# EAGLE design Netzteil_CA1 (EAGLE 8.6.3)

## Sheet 1 of 3
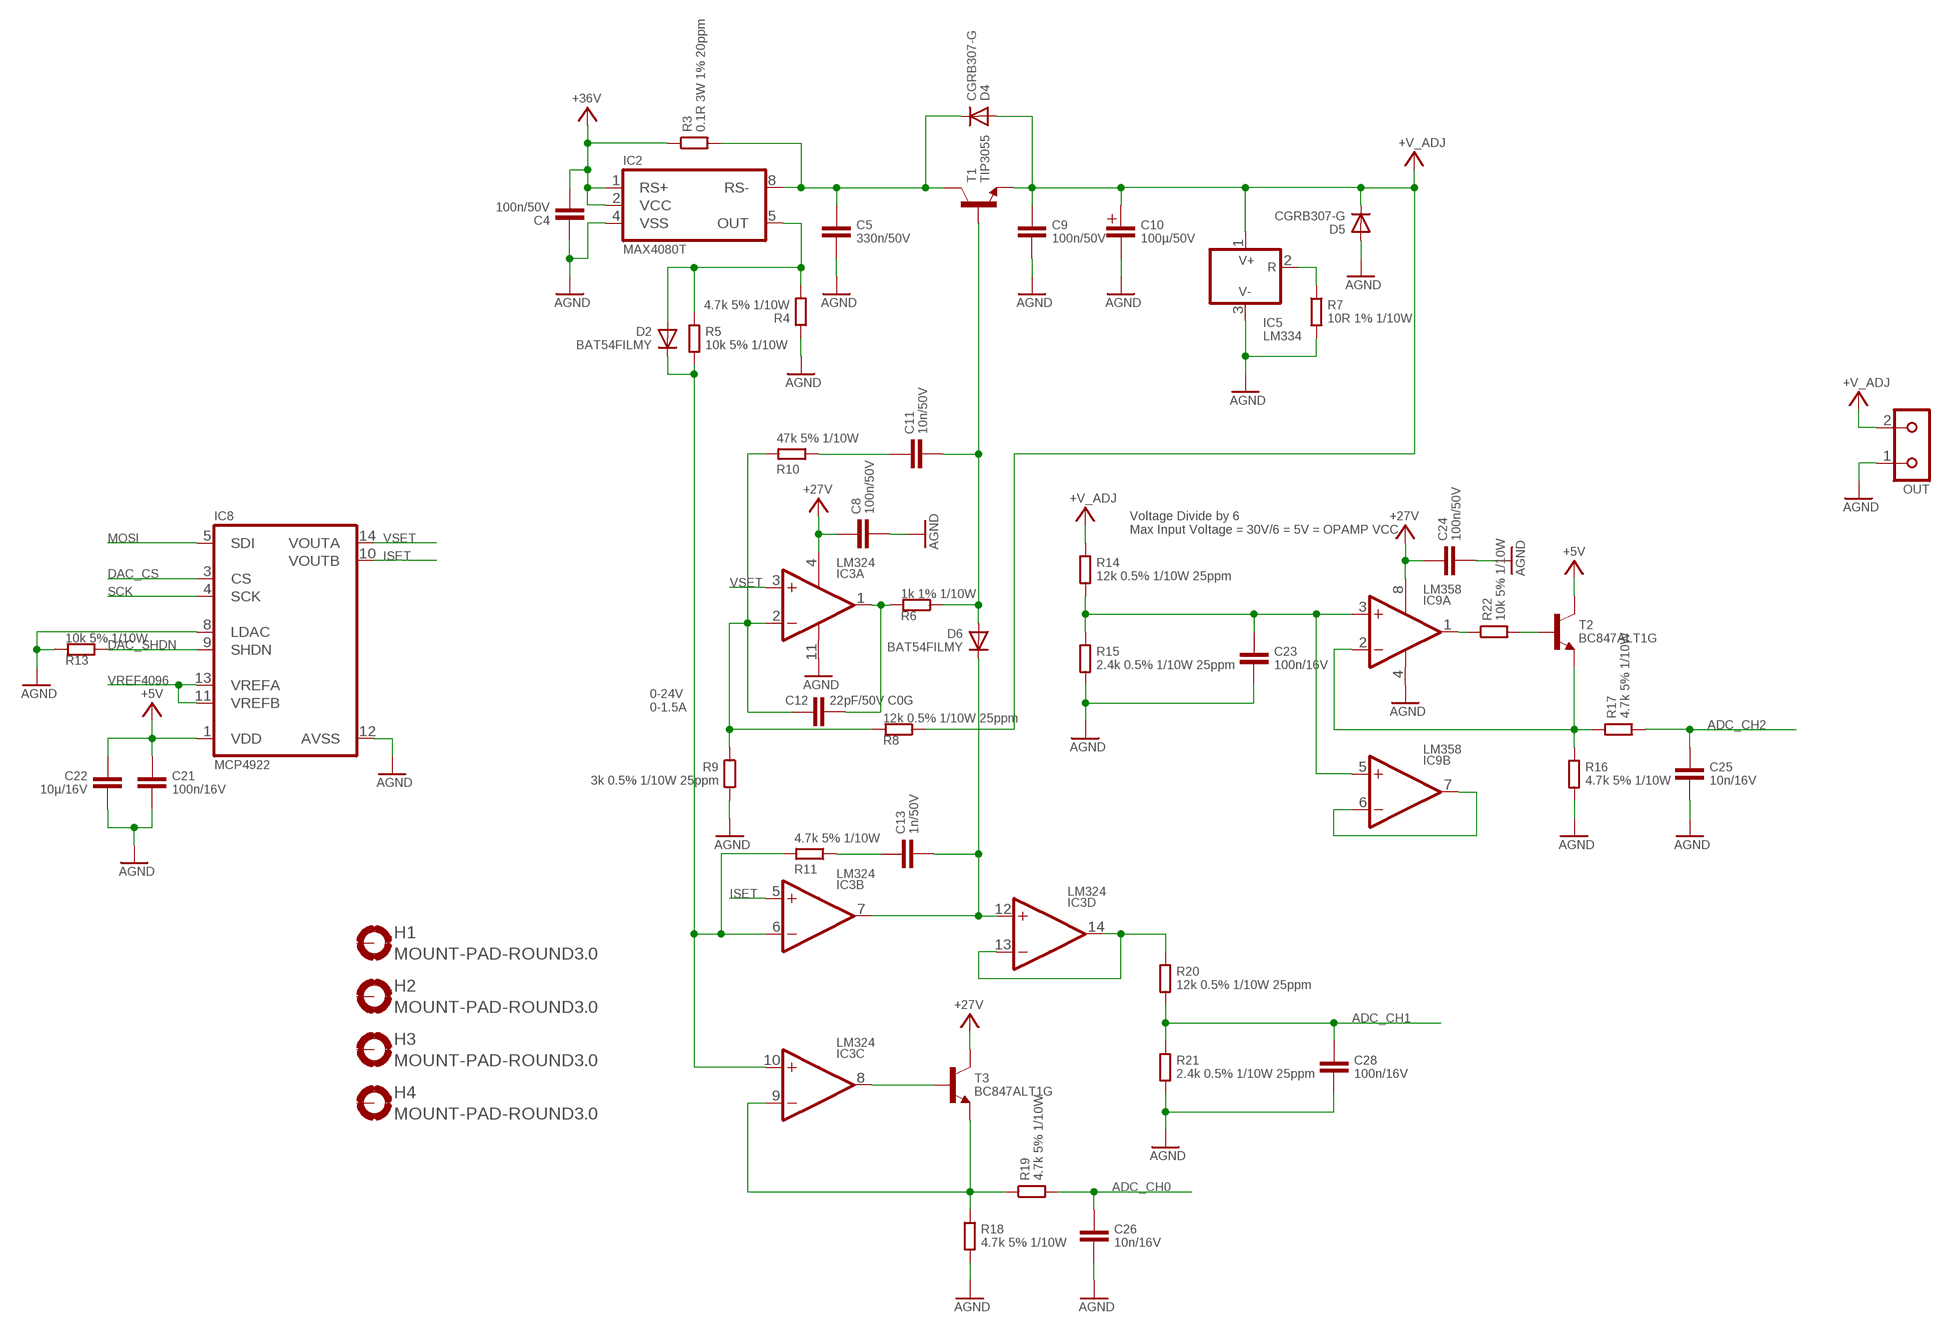
[diagram p0: schematic, sheet 1]

### Parts
C4  100n/50V  CC/0805  [0805]
C5  330n/50V  CC/0805  [0805]
C8  100n/50V  CC/0805  [0805]
C9  100n/50V  CC/0805  [0805]
C10  100µ/50V  C+3.5/8  [C+/3.5/8]
C11  10n/50V  CC/0805  [0805]
C12  22pF/50V C0G  CC/0805  [0805]
C13  1n/50V  CC/0805  [0805]
C21  100n/16V  CC/0805  [0805]
C22  10µ/16V  CC/1206  [1206]
C23  100n/16V  CC/0805  [0805]
C24  100n/50V  CC/0805  [0805]
C25  10n/16V  CC/0805  [0805]
C26  10n/16V  CC/0805  [0805]
C28  100n/16V  CC/0805  [0805]
D2  BAT54FILMY  DBAT54FILMY  [SOT23]
D4  CGRB307-G  DWIDE  [DO214AA-CGRB307-G]
D5  CGRB307-G  DWIDE  [DO214AA-CGRB307-G]
D6  BAT54FILMY  DBAT54FILMY  [SOT23]
H1  MOUNT-PAD-ROUND3.0  [3,0-PAD]
H2  MOUNT-PAD-ROUND3.0  [3,0-PAD]
H3  MOUNT-PAD-ROUND3.0  [3,0-PAD]
H4  MOUNT-PAD-ROUND3.0  [3,0-PAD]
IC2  MAX4080T  MAX4080  [SOP8]
IC3  LM324  QUAD-OPVOPA4197  [SO14]
IC5  LM334  [TO92-G]
IC8  MCP4922  [TSSOP14]
IC9  LM358  DUAL-OPVSOP8  [SOP8]
OUT  KL2691311500002  [KL2-691311500002]
R3  0.1R 3W 1% 20ppm  R-SMDGMR100  [GMR100]
R4  4.7k 5% 1/10W  R-SMD0805  [C0805K]
R5  10k 5% 1/10W  R-SMD0805  [C0805K]
R6  1k 1% 1/10W  R-SMD0805  [C0805K]
R7  10R 1% 1/10W  R-SMD0805  [C0805K]
R8  12k 0.5% 1/10W 25ppm  R-SMD0805  [C0805K]
R9  3k 0.5% 1/10W 25ppm  R-SMD0805  [C0805K]
R10  47k 5% 1/10W  R-SMD0805  [C0805K]
R11  4.7k 5% 1/10W  R-SMD0805  [C0805K]
R13  10k 5% 1/10W  R-SMD0805  [C0805K]
R14  12k 0.5% 1/10W 25ppm  R-SMD0805  [C0805K]
R15  2.4k 0.5% 1/10W 25ppm  R-SMD0805  [C0805K]
R16  4.7k 5% 1/10W  R-SMD0805  [C0805K]
R17  4.7k 5% 1/10W  R-SMD0805  [C0805K]
R18  4.7k 5% 1/10W  R-SMD0805  [C0805K]
R19  4.7k 5% 1/10W  R-SMD0805  [C0805K]
R20  12k 0.5% 1/10W 25ppm  R-SMD0805  [C0805K]
R21  2.4k 0.5% 1/10W 25ppm  R-SMD0805  [C0805K]
R22  10k 5% 1/10W  R-SMD0805  [C0805K]
T1  TIP3055  T-NPNTOP3AV-BCE  [TOP3AV]
T2  BC847ALT1G  T-NPNSOT23-BEC  [SOT23-BEC]
T3  BC847ALT1G  T-NPNSOT23-BEC  [SOT23-BEC]

### Nets
+5V: C21.1 C22.1 IC8.1(VDD) T2.C ; also sheet 2,3
+27V: C8.1 C24.1 IC3.4(PWR:V+) IC9.8(PWR:V+) T3.C ; also sheet 2
+36V: C4.2 IC2.1(RS+) IC2.2(VCC) R3.1 ; also sheet 2
+V_ADJ: C9.1 C10.+ D4.A D5.C IC5.1(V+) OUT.2 R8.1 R14.1 T1.E
ADC_CH0: C26.1 R19.2 ; also sheet 3
ADC_CH1: C28.1 R20.2 R21.1 ; also sheet 3
ADC_CH2: C25.1 R17.2 ; also sheet 3
AGND: C4.1 C5.2 C8.2 C9.2 C10.- C21.2 C22.2 C23.2 C24.2 C25.2 C26.2 C28.2 D5.A IC2.4(VSS) IC3.11(PWR:V-) IC5.3(V-) IC8.8(LDAC) IC8.12(AVSS) IC9.4(PWR:V-) OUT.1 R4.1 R7.2 R9.2 R13.2 R15.2 R16.2 R18.2 R21.2 ; also sheet 2,3
DAC_CS: IC8.3(CS) ; also sheet 3
DAC_SHDN: IC8.9(SHDN) R13.1 ; also sheet 3
ISET: IC3.5(B:+IN) IC8.10(VOUTB)
MOSI: IC8.5(SDI) ; also sheet 3
N$4: C5.1 D4.C IC2.8(RS-) R3.2 T1.C
N$5: D2.1(A) IC2.5(OUT) R4.2 R5.1
N$6: D2.3(C) IC3.6(B:-IN) IC3.10(C:+IN) R5.2 R11.2
N$7: C12.2 IC3.1(A:OUT) R6.2
N$8: C11.2 D6.1(A) R6.1 T1.B
N$9: C11.1 R10.1
N$10: C13.2 D6.3(C) IC3.7(B:OUT) IC3.12(D:+IN)
N$11: IC3.13(D:-IN) IC3.14(D:OUT) R20.1
N$12: C13.1 R11.1
N$13: IC5.2(R) R7.1
N$16: IC9.1(A:OUT) R22.1
N$17: C23.1 IC9.3(A:+IN) IC9.5(B:+IN) R14.2 R15.1
N$18: C12.1 IC3.2(A:-IN) R8.2 R9.1 R10.2
N$19: IC9.2(A:-IN) R16.1 R17.1 T2.E
N$20: IC3.9(C:-IN) R18.1 R19.1 T3.E
N$21: R22.2 T2.B
N$24: IC3.8(C:OUT) T3.B
N$25: IC9.6(B:-IN) IC9.7(B:OUT)
SCK: IC8.4(SCK) ; also sheet 3
VREF4096: IC8.11(VREFB) IC8.13(VREFA) ; also sheet 2,3
VSET: IC3.3(A:+IN) IC8.14(VOUTA)
Unconnected: H1.B3,0(MOUNT) H2.B3,0(MOUNT) H3.B3,0(MOUNT) H4.B3,0(MOUNT)

### Notes on the sheet
- Voltage Divide by 6
  Max Input Voltage = 30V/6 = 5V = OPAMP VCC
- 0-24V
  0-1.5A

## Sheet 2 of 3
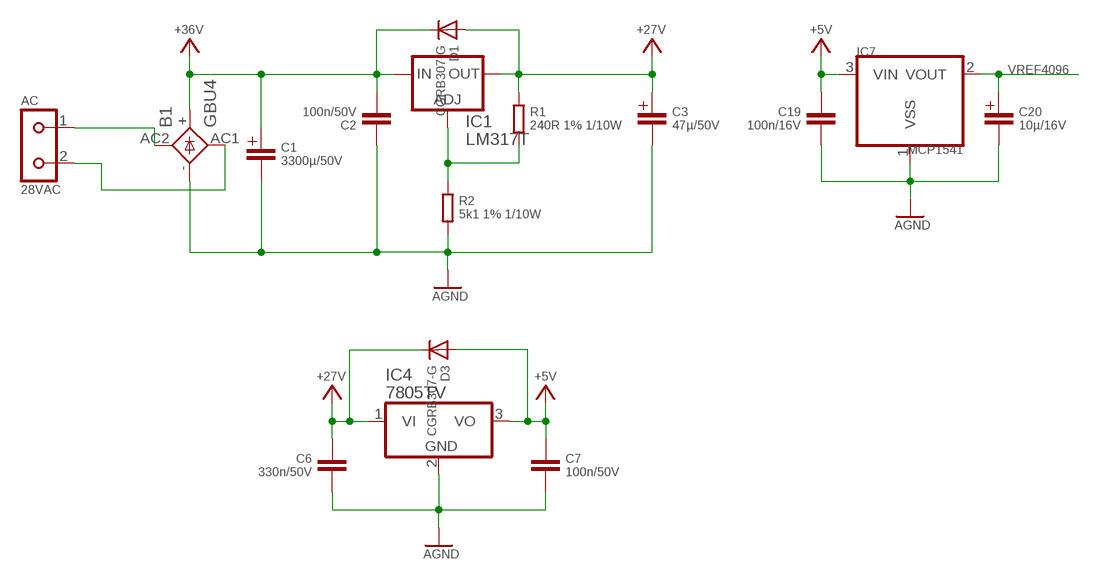
[diagram p1: schematic, sheet 2]

### Parts
AC  28VAC  KL2691311500002  [KL2-691311500002]
B1  GBU4  GBU8M  [GBU4S]
C1  3300µ/50V  C+7.5/18  [C+/7.5/18]
C2  100n/50V  CC/0805  [0805]
C3  47µ/50V  C+2.5/6.3  [C+/2.5/6.3]
C6  330n/50V  CC/0805  [0805]
C7  100n/50V  CC/0805  [0805]
C19  100n/16V  CC/0805  [0805]
C20  10µ/16V  C+1.5/4  [C+/1.5/4]
D1  CGRB307-G  DWIDE  [DO214AA-CGRB307-G]
D3  CGRB307-G  DWIDE  [DO214AA-CGRB307-G]
IC1  LM317T  LM317TS  [317TS]
IC4  7805TV  [TO220V]
IC7  MCP1541  [TO92-G]
R1  240R 1% 1/10W  R-SMD0805  [C0805K]
R2  5k1 1% 1/10W  R-SMD0805  [C0805K]

### Nets
+5V: C7.1 C19.1 D3.A IC4.3(VO) IC7.3(VIN) ; also sheet 1,3
+27V: C3.+ C6.1 D1.A D3.C IC1.2(OUT) IC4.1(VI) R1.1 ; also sheet 1
+36V: B1.+ C1.+ C2.2 D1.C IC1.3(IN) ; also sheet 1
AGND: B1.- C1.- C2.1 C3.- C6.2 C7.2 C19.2 C20.- IC4.2(GND) IC7.1(VSS) R2.2 ; also sheet 1,3
N$1: AC.1 B1.AC2(AC1)
N$2: AC.2 B1.AC1(AC2)
N$3: IC1.1(ADJ) R1.2 R2.1
VREF4096: C20.+ IC7.2(VOUT) ; also sheet 1,3

## Sheet 3 of 3
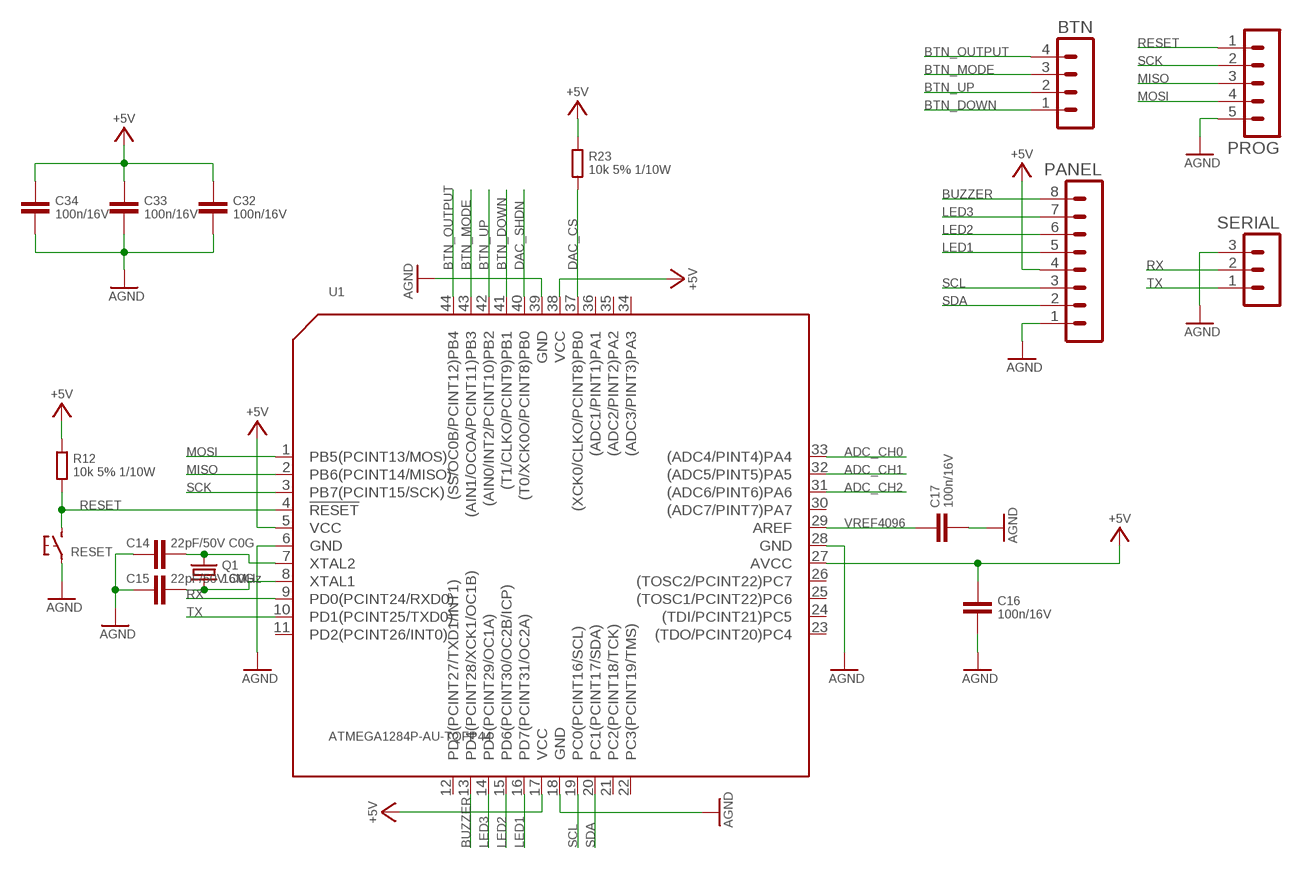
[diagram p2: schematic, sheet 3]

### Parts
BTN  JST-PH-2.0-4P  [JST-PH-2.0-4P]
C14  22pF/50V C0G  CC/0805  [0805]
C15  22pF/50V C0G  CC/0805  [0805]
C16  100n/16V  CC/0805  [0805]
C17  100n/16V  CC/0805  [0805]
C32  100n/16V  CC/0805  [0805]
C33  100n/16V  CC/0805  [0805]
C34  100n/16V  CC/0805  [0805]
PANEL  JST-PH-2.0-8P  [JST-PH-2.0-8P]
PROG  MA05-1  [MA05-1]
Q1  16MHz  Q5X3.2MM-TXC-7A-SERIES  [Q-5X3.2MM-TXC-7A.SERIES]
R12  10k 5% 1/10W  R-SMD0805  [C0805K]
R23  10k 5% 1/10W  R-SMD0805  [C0805K]
RESET  TS1B3F-10XX  [B3F-10XX]
SERIAL  JST-PH-2.0-3P  [JST-PH-2.0-3P]
U1  ATMEGA1284P-AU-TQFP44  MCU-ATMEGA1284P-AU(TQFP44)  [TQFP44-0.8-9.6X9.6MM]

### Nets
+5V: C16.1 C32.1 C33.1 C34.1 PANEL.4 R12.1 R23.1 U1.5(VCC) U1.17(VCC) U1.27(AVCC) U1.38(VCC) ; also sheet 1,2
ADC_CH0: U1.33((ADC4/PINT4)PA4) ; also sheet 1
ADC_CH1: U1.32((ADC5/PINT5)PA5) ; also sheet 1
ADC_CH2: U1.31((ADC6/PINT6)PA6) ; also sheet 1
AGND: C14.1 C15.1 C16.2 C17.2 C32.2 C33.2 C34.2 PANEL.1 PROG.5 RESET.1 SERIAL.3 U1.6(GND) U1.18(GND) U1.28(GND) U1.39(GND) ; also sheet 1,2
BTN_DOWN: BTN.1 U1.41((T1/CLKO/PCINT9)PB1)
BTN_MODE: BTN.3 U1.43((AIN1/OCOA/PCINT11)PB3)
BTN_OUTPUT: BTN.4 U1.44((SS/OC0B/PCINT12)PB4)
BTN_UP: BTN.2 U1.42((AIN0/INT2/PCINT10)PB2)
BUZZER: PANEL.8 U1.13(PD4(PCINT28/XCK1/OC1B))
DAC_CS: R23.2 U1.37((XCK0/CLKO/PCINT8)PB0) ; also sheet 1
DAC_SHDN: U1.40((T0/XCK0O/PCINT8)PB0) ; also sheet 1
LED1: PANEL.5 U1.16(PD7(PCINT31/OC2A))
LED2: PANEL.6 U1.15(PD6(PCINT30/OC2B/ICP))
LED3: PANEL.7 U1.14(PD5(PCINT29/OC1A))
MISO: PROG.3 U1.2(PB6(PCINT14/MISO))
MOSI: PROG.4 U1.1(PB5(PCINT13/MOS)) ; also sheet 1
N$14: C14.2 Q1.2 U1.7(XTAL2)
N$15: C15.2 Q1.1 U1.8(XTAL1)
RESET: PROG.1 R12.2 RESET.3 U1.4(!RESET)
RX: SERIAL.2 U1.9(PD0(PCINT24/RXD0))
SCK: PROG.2 U1.3(PB7(PCINT15/SCK)) ; also sheet 1
SCL: PANEL.3 U1.19(PC0(PCINT16/SCL))
SDA: PANEL.2 U1.20(PC1(PCINT17/SDA))
TX: SERIAL.1 U1.10(PD1(PCINT25/TXD0))
VREF4096: C17.1 U1.29(AREF) ; also sheet 1,2
Unconnected: U1.11(PD2(PCINT26/INT0)) U1.12(PD3(PCINT27/TXD1/INT1)) U1.21(PC2(PCINT18/TCK)) U1.22(PC3(PCINT19/TMS)) U1.23((TDO/PCINT20)PC4) U1.24((TDI/PCINT21)PC5) U1.25((TOSC1/PCINT22)PC6) U1.26((TOSC2/PCINT22)PC7) U1.30((ADC7/PINT7)PA7) U1.34((ADC3/PINT3)PA3) U1.35((ADC2/PINT2)PA2) U1.36((ADC1/PINT1)PA1)

## Library data of the parts
AC OUT = neumluc:KL2: Printklemme 2-polig; OC_MOUSER: 710-691311500002
B1 = neumluc:GBU8M: GENERAL INSTRUMENT RECTIFIER; OC_MOUSER: 833-GBU4JL-BP
BTN = neumluc:JST-PH-2.0-4P: PIN HEADER; OC_DIGIKEY: 455-1706-ND
C1 = neumluc:C+; OC_MOUSER: 647-UVZ1H332MHD
C2 C4 C7-C9 C16 C17 C19 C21 C23 C24 C28 C32-C34 = goujine:C: Kondensator; OC_MOUSER: 810-C2012X7R2A104K
C3 = neumluc:C+; OC_MOUSER: 667-EEU-FR1H470
C5 C6 = goujine:C: Kondensator; OC_MOUSER: 80-C0805C334K5RECTU
C10 = neumluc:C+; OC_MOUSER: 667-EEU-FR1H101
C11 C25 C26 = goujine:C: Kondensator; OC_MOUSER: 80-C0805C103K1R
C12 C14 C15 = goujine:C: Kondensator; OC_MOUSER: 603-CC805JRNPO9BN220
C13 = goujine:C: Kondensator; OC_MOUSER: 603-CC805KRX7R0BB102
C20 = neumluc:C+; OC_MOUSER: 647-USV1C100MFD1TP
C22 = goujine:C: Kondensator; OC_MOUSER: 963-TMK316AB7106KL-T
D1 D3-D5 = neumluc:D; OC_MOUSER: 750-CGRB307-G
D2 D6 = neumluc:D; OC_MOUSER: 511-BAT54FILMY
H1-H4 = holes:MOUNT-PAD-ROUND: MOUNTING PAD, round
IC1 = v-reg:LM317TS: VOLTAGE REGULATOR; OC_MOUSER: 511-LM317T
IC2 = neumluc:MAX4080; OC_MOUSER: 700-MAX4080TASA
IC3 = neumluc:QUAD-OPV; OC_MOUSER: 595-LM324ADR
IC4 = linear:78*: Positive VOLTAGE REGULATOR Source: http://cache.national.com/ds/LM/LM78L05.pdf http://www.fairchildsemi.com/ds/LM/LM7805.pdf; OC_MOUSER: 511-L7805CV
IC5 = neumluc:LM334: LM134/LM234/LM334 3-Terminal Adjustable Current Sources; OC_MOUSER: 926-LM334Z/NOPB
IC7 = neumluc:MCP1541: LM134/LM234/LM334 3-Terminal Adjustable Current Sources; OC_MOUSER: 579-MCP1541ITO
IC8 = neumluc:MCP4922; OC_MOUSER: 579-MCP4922T-E/ST
IC9 = goujine:DUAL-OPV; OC_MOUSER: 595-LM358ADR
PANEL = neumluc:JST-PH-2.0-8P: PIN HEADER
PROG = con-lstb:MA05-1: PIN HEADER; OC_FARNELL: unknown; OC_MOUSER: 710-61300511121; OC_NEWARK: unknown
Q1 = neumluc:Q; OC_MOUSER: 717-7A-16.000MAAJ-T
R1 = neumluc:R-SMD: R SMD; OC_MOUSER: 652-CR0805FX-2400ELF
R2 = neumluc:R-SMD: R SMD; OC_MOUSER: 652-CR0805FX-5101ELF
R3 = neumluc:R-SMD: R SMD; OC_MOUSER: 755-GMR100HTCFAR100
R4 R11 R16-R19 = neumluc:R-SMD: R SMD; OC_MOUSER: 652-CR0805-JW-472ELF
R5 R12 R13 R22 R23 = neumluc:R-SMD: R SMD; OC_MOUSER: 652-CR0805-JW-103ELF
R6 = neumluc:R-SMD: R SMD; OC_MOUSER: 652-CR0805FX-1001ELF
R7 = neumluc:R-SMD: R SMD; OC_MOUSER: 652-CR0805FX-10R0ELF
R8 R14 R20 = neumluc:R-SMD: R SMD; OC_MOUSER: 754-RR1220P-123D
R9 = neumluc:R-SMD: R SMD; OC_MOUSER: 754-RR1220P-302D
R10 = neumluc:R-SMD: R SMD; OC_MOUSER: 652-CR0805JW-473ELF
R15 R21 = neumluc:R-SMD: R SMD; OC_MOUSER: 754-RR1220P-242D
RESET = neumluc:TS1; OC_MOUSER: 653-B3F-1022
SERIAL = neumluc:JST-PH-2.0-3P: PIN HEADER
T1 = neumluc:T-NPN: NPN Transistor; OC_MOUSER: 863-TIP3055G
T2 T3 = neumluc:T-NPN: NPN Transistor; OC_MOUSER: 863-BC847ALT1G
U1 = Seeed-OPL-ic:MCU-ATMEGA1284P-AU(TQFP44): 310010020; MPN: ATMEGA1284P-AU; OC_MOUSER: 556-ATMEGA1284P-AU

## Board
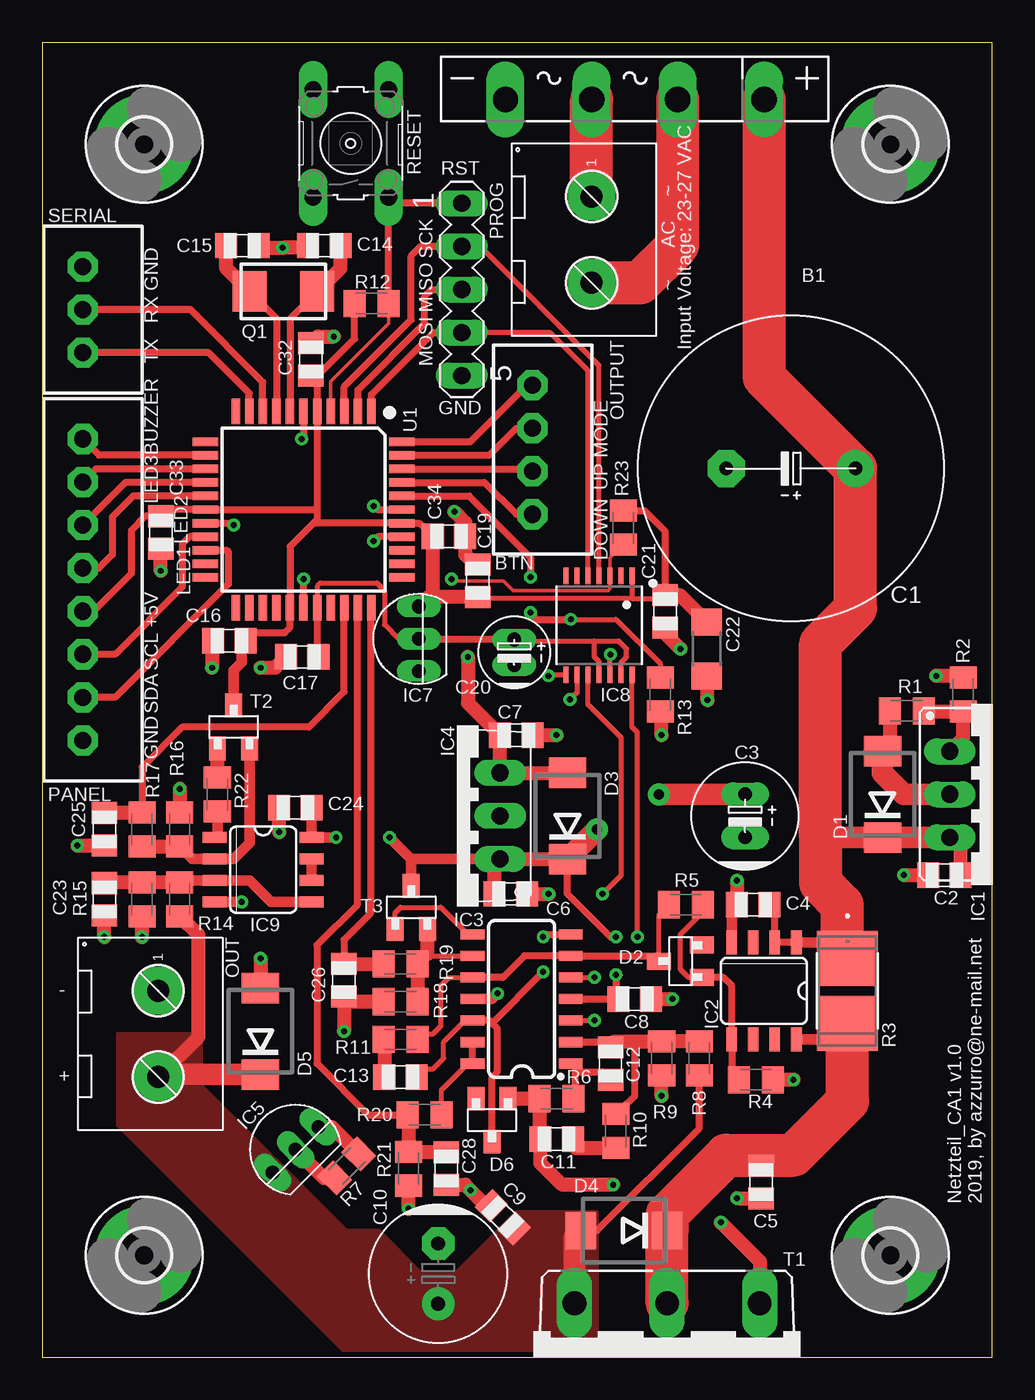
[diagram p3: board, top side]
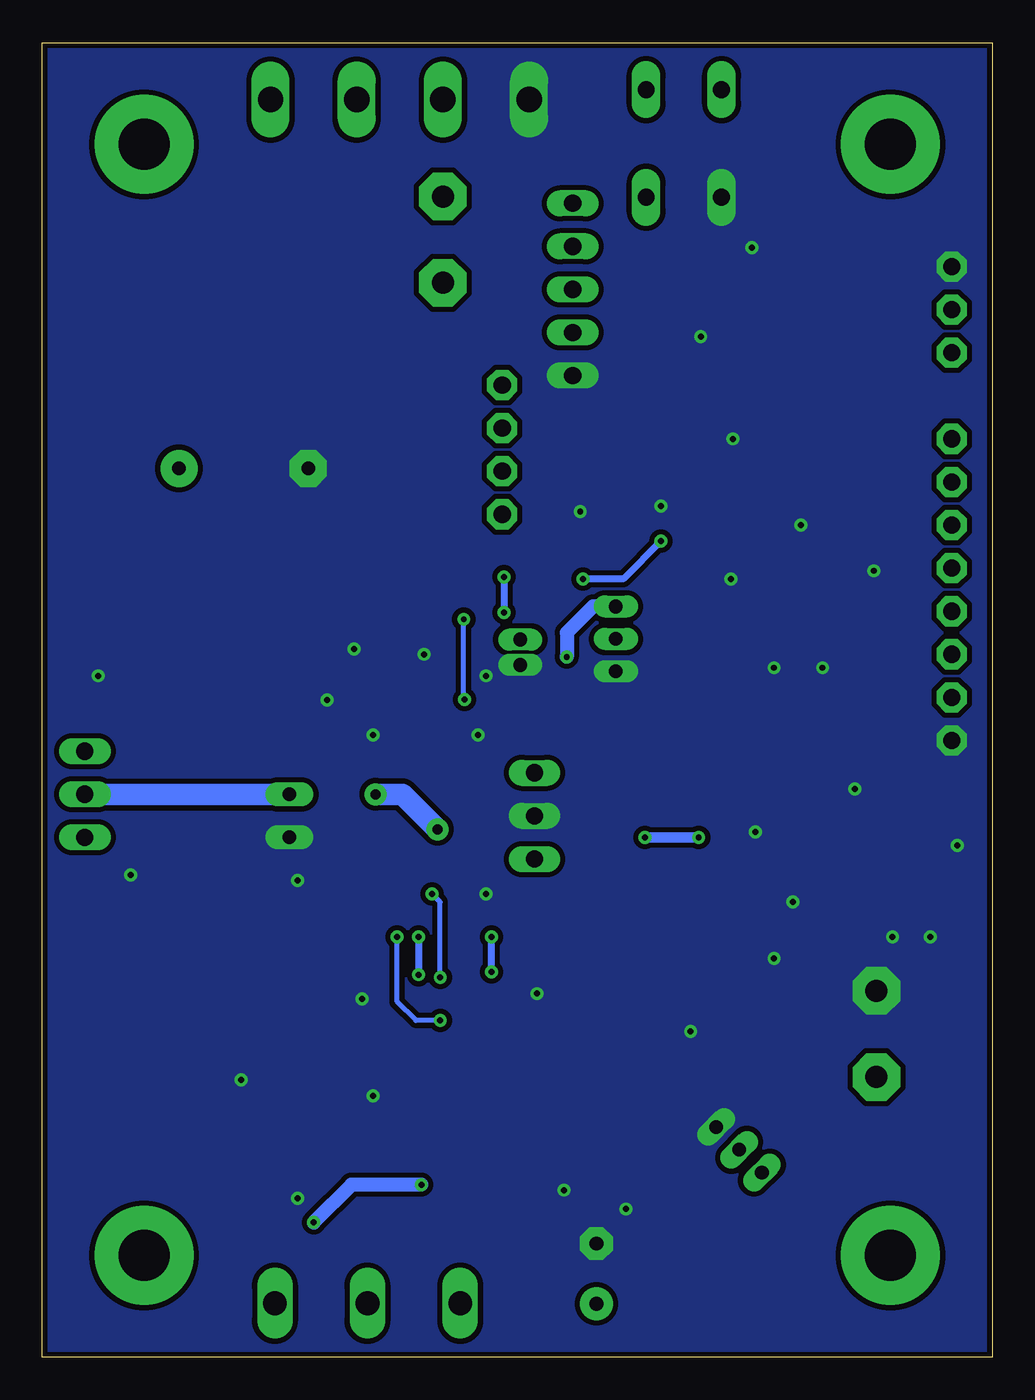
[diagram p4: board, bottom side, seen from below]

Size 56 x 77.5 mm. Coordinates in mm from the lower left corner, seen from the top.
Outline: 0,0 56,0 56,77.5 0,77.5 0,0
Copper layers (1*16): Top 0.035mm / dielectric 1.5mm / Bottom 0.035mm
Design rules "default *": minimum track width 5mil, minimum drill 0.35mm, track to track 5mil, track to pad 5mil, pad to pad 5mil, via to via 5mil, smd to smd 5mil, copper to edge 8mil, drill to drill 6mil, minimum pad ring 10mil, minimum via ring 8mil, stop-mask expansion 4mil, vias tented up to drill 0mil, thermal gap 10mil

### Footprints (pad centres in the part's own frame; a part is rotated, then mirrored left to right if it is on the bottom)
KL2-691311500002 = drill 1.3 pad 2.8 octagon: 1 -2.54,0; 2 2.54,0
GBU4S = drill 1.499 long: + 7.62,0; - -7.62,0; AC1 2.54,0; AC2 -2.54,0
JST-PH-2.0-4P = drill 1.016 pad 1.778 octagon: 1 -3.81,0; 2 -1.27,0; 3 1.27,0; 4 3.81,0
C+/7.5/18 = drill 0.8 pad 2.184: + -3.81,0 | drill 0.8 pad 2.184 octagon: - 3.81,0
0805 = smd 1.3 x 1.5: 1 -0.953,0; 2 0.953,0
C+/2.5/6.3 = drill 0.8 pad 1.422 long: + -1.27,0; - 1.27,0
C+/3.5/8 = drill 0.813 pad 1.93: + -1.778,0 | drill 0.813 pad 1.93 octagon: - 1.778,0
C+/1.5/4 = drill 0.8 pad 1.15 long: + -0.75,0; - 0.75,0
1206 = smd 1.803 x 1.6: 1 0,1.587; 2 0,-1.587
DO214AA-CGRB307-G = smd 1.8 x 2.2: A 2.55,0; C -2.55,0
SOT23 = smd 1 x 1.4: 1 -0.953,-1.27; 2 0.953,-1.27; 3 0,1.27
3,0-PAD = drill 3 pad 5.842: B3,0 0,0
317TS = drill 1.016 long: 1 -2.54,-2.54; 2 0,-2.54; 3 2.54,-2.54
SOP8 = smd 0.635 x 1.422: 1 -1.905,-2.857; 2 -0.635,-2.857; 3 0.635,-2.857; 4 1.905,-2.857; 5 1.905,2.857; 6 0.635,2.857; 7 -0.635,2.857; 8 -1.905,2.857
SO14 = smd 0.6 x 1.4: 1 -3.81,-2.9; 2 -2.54,-2.9; 3 -1.27,-2.9; 4 0,-2.9; 5 1.27,-2.9; 6 2.54,-2.9; 7 3.81,-2.9; 8 3.81,2.9; 9 2.54,2.9; 10 1.27,2.9; 11 0,2.9; 12 -1.27,2.9; 13 -2.54,2.9; 14 -3.81,2.9
TO220V = drill 1.016 long: 1 -2.54,-2.54; 2 0,-2.54; 3 2.54,-2.54
TO92-G = drill 0.8 pad 1.27 long: 1 -1.905,0; 2 0,0; 3 1.905,0
TSSOP14 = smd 0.305 x 0.991: 1 -1.95,-2.918; 2 -1.3,-2.918; 3 -0.65,-2.918; 4 0,-2.918; 5 0.65,-2.918; 6 1.3,-2.918; 7 1.95,-2.918; 8 1.95,2.918; 9 1.3,2.918; 10 0.65,2.918; 11 0,2.918; 12 -0.65,2.918; 13 -1.3,2.918; 14 -1.95,2.918
JST-PH-2.0-8P = drill 1.016 pad 1.778 octagon: 1 -8.89,0; 2 -6.35,0; 3 -3.81,0; 4 -1.27,0; 5 1.27,0; 6 3.81,0; 7 6.35,0; 8 8.89,0
MA05-1 = drill 1.016 long: 1 -5.08,0; 2 -2.54,0; 3 0,0; 4 2.54,0; 5 5.08,0
Q-5X3.2MM-TXC-7A.SERIES = smd 2 x 2.4: 1 -2,0; 2 2,0
C0805K = smd 1.3 x 1.6: 1 -1,0; 2 1,0
GMR100 = smd 3.25 x 3.6: 1 -1.925,0; 2 1.925,0
B3F-10XX = drill 1 pad 1.676 long: 1 -3.175,1.905; 2 3.175,1.905; 3 -3.175,-2.54; 4 3.175,-2.54
JST-PH-2.0-3P = drill 1.016 pad 1.778 octagon: 1 -2.54,0; 2 0,0; 3 2.54,0
TOP3AV = drill 1.397 long: B -5.461,-3.175; C 0,-3.175; E 5.461,-3.175
SOT23-BEC = smd 1 x 1.4: B -0.953,-1.27; C 0,1.27; E 0.953,-1.27
TQFP44-0.8-9.6X9.6MM = smd 1.5 x 0.5: 1 -5.8,4; 2 -5.8,3.2; 3 -5.8,2.4; 4 -5.8,1.6; 5 -5.8,0.8; 6 -5.8,0; 7 -5.8,-0.8; 8 -5.8,-1.6; 9 -5.8,-2.4; 10 -5.8,-3.2; 11 -5.8,-4; 23 5.8,-4; 24 5.8,-3.2; 25 5.8,-2.4; 26 5.8,-1.6; 27 5.8,-0.8; 28 5.8,0; 29 5.8,0.8; 30 5.8,1.6; 31 5.8,2.4; 32 5.8,3.2; 33 5.8,4 | smd 0.5 x 1.5: 12 -4,-5.8; 13 -3.2,-5.8; 14 -2.4,-5.8; 15 -1.6,-5.8; 16 -0.8,-5.8; 17 0,-5.8; 18 0.8,-5.8; 19 1.6,-5.8; 20 2.4,-5.8; 21 3.2,-5.8; 22 4,-5.8; 34 4,5.8; 35 3.2,5.8; 36 2.4,5.8; 37 1.6,5.8; 38 0.8,5.8; 39 0,5.8; 40 -0.8,5.8; 41 -1.6,5.8; 42 -2.4,5.8; 43 -3.2,5.8; 44 -4,5.8

### Placement (x,y rotation side)
AC  32.38,65.88 270 top
B1  34.92,74.14 0 top
BTN  28.89,53.5 90 top
C1  44.13,52.39 180 top
C2  53.18,28.42 0 top
C3  41.43,31.91 270 top
C4  41.91,26.67 0 top
C5  42.39,10.32 270 top
C6  27.62,27.3 0 top
C7  27.94,36.67 0 top
C8  34.92,21.11 0 top
C9  27.15,8.26 135 top
C10  23.34,4.92 90 top
C11  30.32,12.86 180 top
C12  33.5,17.3 270 top
C13  21.11,16.51 0 top
C14  16.63,65.52 0 top
C15  11.79,65.52 180 top
C16  11.03,42.23 180 top
C17  15.32,41.27 180 top
C19  25.68,45.76 90 top
C20  27.82,41.55 270 top
C21  36.71,43.97 270 top
C22  39.17,41.75 0 top
C23  3.65,26.99 270 top
C24  14.92,32.38 180 top
C25  3.65,31.11 270 top
C26  17.78,22.23 270 top
C28  23.81,11.11 270 top
C32  15.84,58.82 90 top
C33  6.99,48.62 270 top
C34  23.97,48.38 0 top
D1  49.53,33.18 90 top
D2  37.62,23.34 90 top
D3  30.96,31.91 90 top
D4  34.29,7.46 180 top
D5  12.86,19.21 90 top
D6  26.51,13.97 180 top
H1  6,6 0 top
H2  6,71.5 0 top
H3  50,71.5 0 top
H4  50,6 0 top
IC1  56.04,33.18 270 top
IC2  42.55,21.59 180 top
IC3  28.26,21.11 90 top
IC4  24.45,31.91 90 top
IC5  14.92,12.22 45 top
IC7  22.19,42.35 90 top
IC8  32.82,43.14 180 top
IC9  13.02,28.73 270 top
OUT  6.83,19.05 270 top
PANEL  2.38,45.24 90 top
PROG  24.73,62.94 270 top
Q1  14.21,62.83 0 top
R1  50.96,38.1 0 top
R2  54.29,39.05 90 top
R3  47.47,21.59 270 top
R4  42.07,16.35 180 top
R5  37.94,26.67 180 top
R6  30.32,15.24 0 top
R7  17.94,11.27 45 top
R8  38.73,17.62 90 top
R9  36.51,17.62 270 top
R10  33.81,13.34 90 top
R11  21.11,18.73 0 top
R12  19.41,62.11 0 top
R13  36.43,39.05 270 top
R14  8.1,26.99 90 top
R15  5.87,26.99 270 top
R16  8.1,31.11 90 top
R17  5.87,31.11 90 top
R18  21.11,20.95 180 top
R19  21.11,23.18 180 top
R20  22.54,14.29 180 top
R21  21.59,11.11 270 top
R22  10.32,33.18 90 top
R23  34.25,48.9 270 top
RESET  17.86,71.56 90 top
SERIAL  2.38,61.75 90 top
T1  36.83,0 180 top
T2  11.27,37.15 0 top
T3  21.75,26.51 0 top
U1  15.4,49.97 270 top

### Tracks (layer width: path | path; a pad name or v marks a point on that pad's centre or on a via)
+5V  (via drill 0.35)
  Top 0.305: C21.1 36.35,44.73 34.77,44.73 | IC8.1 34.77,44.89 34.77,44.73 | 34.77,44.73 25.76,44.73 C19.1
  Top 0.406: 16.2,49.97 U1.5 16.2,57.83 | 16.2,49.97 16.2,49.38 16.03,49.21 | 16.03,49.21 14.6,47.78 U1.27 14.6,43.02 14.29,42.7 12.46,42.7 C16.1 | 16.2,49.97 U1.17 7.38,49.97 C33.1 6.07,49.57 5.24,48.74 5.24,46.2 3.02,43.97 PANEL.4 | 16.03,49.21 16.08,49.17 U1.38 | C32.1 16.2,57.9 16.2,57.83 | R12.1 18.41,60.04 16.2,57.83 | U1.38 | U1.38 22.23,49.17 C34.1 | R23.1 35.51,49.9 36.71,48.7 C21.1
  Top 0.61: T2.C 11.27,40.48 11.75,40.96 11.75,41.99 C16.1
  Top 0.813: D3.A 30.95,34.45 IC4.3 C7.1 25.08,38.58 v25.08,41.27 | 23.02,44.85 C34.1 | 23.02,44.85 22.42,44.25 IC7.3 22.74,44.81 | C22.1 37.58,44.93 C21.1 | C19.1 23.06,44.81 23.02,44.85
  Bottom 0.813: 27.3,34.77 IC4.3 | IC7.3 23.54,44.25 25.08,42.7 v25.08,41.27
+27V  (via drill 0.35, 0.6 pad 1.3)
  Top 0.305: C24.1 15.72,32.54
  Top 0.406: IC3.4 C8.1 33.81,21.27 v33.81,22.54 | v33.81,24.77 33.5,24.77 30.95,27.32 30.95,29.37
  Top 0.61: C24.1 IC9.8 v17.3,30.64 | v20.48,30.64 21.75,29.37 | 21.75,29.37 T3.C | IC4.1 21.75,29.37
  Top 0.813: 28.26,29.37 IC4.1 | IC4.1 30.95,29.37 D3.C | R1.1 49.96,36.16 D1.A | C6.1 26.67,29.05 IC4.1 | v32.7,31.11
  Top 1.27: D1.A 49.53,34.45 50.8,33.18 IC1.2 | D3.C v32.7,31.11 | v36.35,33.18 C3.+
  Bottom 0.406: v33.81,24.77 v33.81,22.54
  Bottom 0.61: v17.3,30.64 v20.48,30.64
  Bottom 1.27: IC1.2 C3.+ | v32.7,31.11 34.77,33.18 v36.35,33.18
+36V
  Top 0.406: IC2.1 IC2.2 43.18,26.35 C4.2
  Top 0.61: IC2.1 46.53,24.45 R3.1
  Top 0.813: IC1.3 54.13,30 C2.2
  Top 1.27: IC1.3 53.49,30.63 D1.C 45.88,30.64
  Top 2.54: R3.1 47.15,23.83 47.15,26.67 45.88,27.94 45.88,30.64 45.88,42.07 47.94,44.13 C1.+ 42.55,57.78 B1.+
+V_ADJ
  Top 0.406: R8.1 38.73,13.49 32.7,7.46 D4.A
  Top 0.813: OUT.2 9.21,18.89 9.21,24.88 R14.1
  Top 1.27: T1.E 31.37,7.09 D4.A | D5.C 6.97,16.66 OUT.2
  pour Top (isolate 0.305, no thermals): 32.7,8.57 27.94,8.57 24.29,4.92 22.38,4.92 19.84,7.46 17.94,7.46 9.37,16.03 9.37,19.05 4.45,19.05 4.45,13.65 17.78,0.32 32.7,0.32
ADC_CH0
  Top 0.406: C26.1 17.78,24.61 19.37,26.19 19.37,44.13 U1.33
  Top 0.813: C26.1 R19.2
ADC_CH1
  Top 0.305: R20.2 21.59,14.24 | 23.77,12.11 C28.1
  Top 0.406: R20.2 19.21,14.29 16.19,17.3 16.19,24.29 18.57,26.67 18.57,44.14 U1.32
  Top 0.813: 21.59,14.24 R21.1 23.77,12.11
ADC_CH2
  Top 0.305: 6.14,32.07 R17.2
  Top 0.406: U1.31 17.8,39.23 15.72,37.15 8.26,37.15 5.87,34.77 R17.2
  Top 0.813: R17.2 5.83,32.07 C25.1
AGND  (via drill 0.35)
  Top 0.305: IC8.8 29.9,40.22 v29.84,40.16 | IC8.12 33.47,41.41 v33.5,41.43
  Top 0.406: U1.6 15.4,54.25 v15.28,54.13 | U1.18 11.16,49.17 v11.27,49.05 | U1.28 v15.4,45.88 | v19.53,50.16 19.73,49.97 U1.39
  Top 0.61: IC9.4 v11.75,26.83 | IC3.11 26.51,21.11 v26.83,21.43 | IC2.4 40.64,26.35 C4.1
  Top 0.813: v12.86,40.64 13.73,40.64 C17.2 | C19.2 26.04,46.83 25.4,46.83 24.92,47.31 C34.2 24.92,49.21 v24.29,49.85 | C7.2 v30.32,36.67 | v13.97,30.96 C24.2 | v8.1,33.5 R16.2 | v2.06,30.16 C25.2 | v3.65,24.77 C23.2 | v5.87,24.77 R15.2 | v12.86,23.5 D5.A | R18.2 18.1,20.95 C26.2 v17.78,19.21 | C8.2 v37.15,21.11 | v36.51,15.4 R9.2 | v44.29,16.35 R4.1 | v40.96,28.1 C4.1 | v40.96,9.37 C5.2 | C28.2 24.92,10.16 v25.24,9.84 26.16,8.93 C9.2 | v21.59,8.73 R21.2 | IC5.3 17.05,13.57 R7.2 | C32.2 16.23,60.17 v17.18,60.17 | C15.1 12.86,65.41 v14.17,65.41 15.56,65.41 C14.1 | v50.8,28.42 C2.1 | R2.2 54.18,40.16 v52.7,40.16 | C6.2 v29.84,27.3 | C16.2 10,42.15 v10,40.64 | v6.99,46.35 C33.2 | v36.51,36.67 36.51,37.97 R13.2 | v39.21,38.73 39.21,40.12 C22.2 | C21.2 36.71,42.66 v37.62,41.75
  pour Bottom (isolate 0.305, no thermals): 0,0 56.04,0 56.04,77.31 0,77.31
BTN_DOWN
  Top 0.406: BTN.1 27.94,49.69 26.06,51.57 U1.41
BTN_MODE
  Top 0.406: U1.43 21.21,53.18 26.35,53.18 27.94,54.77 BTN.3
BTN_OUTPUT
  Top 0.406: BTN.4 28.57,57.31 25.23,53.97 U1.44
BTN_UP
  Top 0.406: U1.42 28.75,52.37 BTN.2
BUZZER
  Top 0.406: U1.13 3.35,53.17 PANEL.8
DAC_CS  (via drill 0.35)
  Top 0.203: v24.13,45.88 24.25,45.76 27.19,45.76 27.74,45.2 33.38,45.2 33.47,45.3 IC8.3 33.47,47.12 R23.2
  Top 0.406: U1.37 19.79,48.37 v19.53,48.1
  Bottom 0.406: v19.53,48.1 21.75,45.88 v24.13,45.88
DAC_SHDN  (via drill 0.35)
  Top 0.305: IC8.9 31.52,39.18 v31.11,38.77 | v31.16,43.5 33.81,43.5 36.43,40.88 R13.1
  Top 0.406: U1.40 25.16,50.77 28.77,47.15 v28.77,46 | v28.77,43.89 29.17,43.5 v31.16,43.5
  Bottom 0.305: v31.11,38.77 31.16,39.13 v31.16,43.5
  Bottom 0.406: v28.77,46 v28.77,43.89
ISET  (via drill 0.35)
  Top 0.305: IC3.5 v32.54,22.38 | IC8.10 32.17,38.47 34.13,36.51 34.13,28.42 v33.02,27.3
  Bottom 0.305: v32.54,22.38 32.54,26.83 v33.02,27.3
LED1
  Top 0.406: U1.16 5.36,50.77 4.13,49.53 4.13,47.31 3.33,46.51 PANEL.5
LED2
  Top 0.406: U1.15 4.89,51.57 PANEL.6
LED3
  Top 0.406: U1.14 3.15,52.37 PANEL.7
MISO
  Top 0.406: U1.2 18.6,57.02 22.54,60.96 22.54,62.55 22.94,62.94 PROG.3
MOSI
  Top 0.305: IC8.5 32.17,58.16 29.92,60.4 PROG.4
  Top 0.406: U1.1 19.4,56.74 23.06,60.4 PROG.4
N$1
  Top 2.54: AC.1 B1.AC2
N$2
  Top 2.54: AC.2 35.24,63.34 37.47,65.56 B1.AC1
N$3
  Top 0.813: IC1.1 54.29,36.51 R2.1 52.01,38.05 R1.2
N$4
  Top 0.61: IC2.8 46.53,18.73 R3.2
  Top 0.813: C5.1 41.75,11.91 40.32,11.91
  Top 2.54: T1.C D4.C 36.84,8.42 40.32,11.91 44.29,11.91 47.47,15.08 R3.2
N$5
  Top 0.305: D2.1 38.1,22.38 37.62,22.86 37.62,24.92 38.94,26.24
  Top 0.406: 40.59,18.68 IC2.5 | IC2.5 40.64,16.46 R4.2 | IC2.5 40.64,21.91 40.16,22.38 D2.1 | 38.94,26.24 R5.1
N$6
  Top 0.305: R11.2 22.59,19.05 23.02,19.05 23.5,19.53 23.5,21.91 23.97,22.38 IC3.10 | D2.3 36.35,23.5 36.35,26.08 R5.2
  Top 0.406: IC3.10 27.15,22.38 28.42,23.65 IC3.6 36.2,23.65 36.35,23.5
N$7
  Top 0.406: IC3.1 | IC3.1 31.43,17.3 31.43,15.35 R6.2 | IC3.1 31.32,17.14 | IC3.1 31.63,16.83 33.02,16.83 C12.2
N$8  (via drill 0.35)
  Top 0.406: R6.1 29.21,15.19 | 29.32,12.91 C11.2
  Top 0.813: D6.1 R6.1 29.32,12.91 | v40.01,7.94 42.29,5.65 T1.B | C11.2 29.37,11.43 30.64,10.16 v33.66,10.16
  Bottom 0.813: v33.66,10.16 37.78,10.16 v40.01,7.94
N$9
  Top 0.406: C11.1 31.48,12.34
  Top 0.813: 31.48,12.34 R10.1
N$10  (via drill 0.35)
  Top 0.305: C13.2 22.54,16.99 23.02,16.99 23.65,17.62 23.65,18.57 24.92,19.84 IC3.12
  Top 0.406: D6.3 26.51,16.51 26.83,16.83 26.83,19.37 26.51,19.68 | 26.51,19.68 26.35,19.84 IC3.12 | 26.51,19.68 v29.53,22.7 | v29.53,24.77 29.69,24.92 IC3.7
  Bottom 0.406: v29.53,22.7 v29.53,24.77
N$11
  Top 0.305: R20.1 23.54,15.76 25.36,17.58
  Top 0.406: IC3.14 25.36,17.58 IC3.13
N$12
  Top 0.305: R11.1 20.16,18.53
  Top 0.813: 20.16,18.53 C13.1
N$13
  Top 0.813: IC5.2 16.58,10.56 R7.1
N$14
  Top 0.406: Q1.2 14.6,61.22 U1.7
  Top 0.813: Q1.2 17.58,64.2 C14.2
N$15
  Top 0.406: Q1.1 13.8,61.23 U1.8
  Top 0.813: Q1.1 10.84,64.2 C15.2
N$16
  Top 0.61: IC9.1 10.32,30.8 R22.1
N$17
  Top 0.406: 8.21,28.1 R14.2
  Top 0.61: IC9.5 13.49,26.83 12.22,28.1 IC9.3 8.21,28.1
  Top 0.813: R14.2 R15.1 3.7,27.99 C23.1
N$18
  Top 0.406: 34.92,18.57 34.92,15.4 34.18,14.65 R10.2 | R9.1 36.47,18.57 | 33.42,18.34 33.18,18.57 IC3.2 | 33.42,18.34 C12.1 | 33.66,18.57 33.42,18.34
  Top 0.813: R8.2 R9.1 | 36.47,18.57 34.92,18.57 33.66,18.57
N$19
  Top 0.61: T2.E 12.22,30.32 11.27,29.37 IC9.2 8.84,29.37 R16.1
  Top 0.813: R17.1 R16.1
N$20
  Top 0.305: IC3.9 22.59,23.65 R19.1 22.7,23.77
  Top 0.813: R19.1 R18.1 | 22.7,23.77 T3.E
N$21
  Top 0.813: R22.2 T2.B
N$24
  Top 0.305: T3.B 20.8,26.19 21.11,26.51 23.5,26.51 25.08,24.92 IC3.8
N$25
  Top 0.61: IC9.7 IC9.6
RESET
  Top 0.203: U1.4 17,57.52 20.41,60.93 R12.2
  Top 0.406: R12.2 20.41,68.26 | 20.41,68.26 RESET.3 | PROG.1 20.64,68.02 20.41,68.26
RX
  Top 0.406: SERIAL.2 8.73,61.75 13,57.49 U1.9
SCK
  Top 0.305: PROG.2 25.8,65.48 32.82,58.46 IC8.4
  Top 0.406: U1.3 17.8,57.21 21.75,61.16 21.75,64.93 22.3,65.48 PROG.2
SCL
  Top 0.406: U1.19 8.68,48.37 8.26,47.94 8.26,45.4 4.29,41.43 PANEL.3
SDA
  Top 0.406: U1.20 10.85,47.57 10.95,47.47 10.95,45.56 4.29,38.89 PANEL.2
TX
  Top 0.406: U1.10 12.2,56.82 9.8,59.21 SERIAL.1
VREF4096
  Top 0.305: U1.29 16.2,45.45 16.39,45.64 19.73,45.64 20.16,45.2 20.16,43.18 21,42.35 IC7.2 | IC8.13 34.12,40.95 34.45,41.27 34.45,41.75 33.97,42.23 32.54,42.23 | IC8.11 32.82,41 32.54,41.27 32.54,42.23 | C20.+ 27.9,42.23 32.54,42.23
  Top 0.406: U1.29 16.2,41.35 C17.1 | IC7.2 27.78,42.35 C20.+
VSET  (via drill 0.35)
  Top 0.305: IC3.3 v32.54,19.84 | v35.08,24.77 35.08,36.83 34.77,37.14 IC8.14
  Bottom 0.305: v32.54,19.84 33.97,19.84 35.08,20.95 v35.08,24.77

### Text on the board
tNames: RST | ~ | SCK | GND | ~ | MISO | RX | TX | Input Voltage: 23-27 VAC | MOSI | GND | OUTPUT | BUZZER | MODE | UP | LED3 | LED2 | DOWN | LED1 | +5V | SCL | SDA | GND | - | + | Netzteil_CA1 v1.0 / 2019, by azzurro@ne-mail.net